# Altium project LM_001_Rev_D.PrjPcb
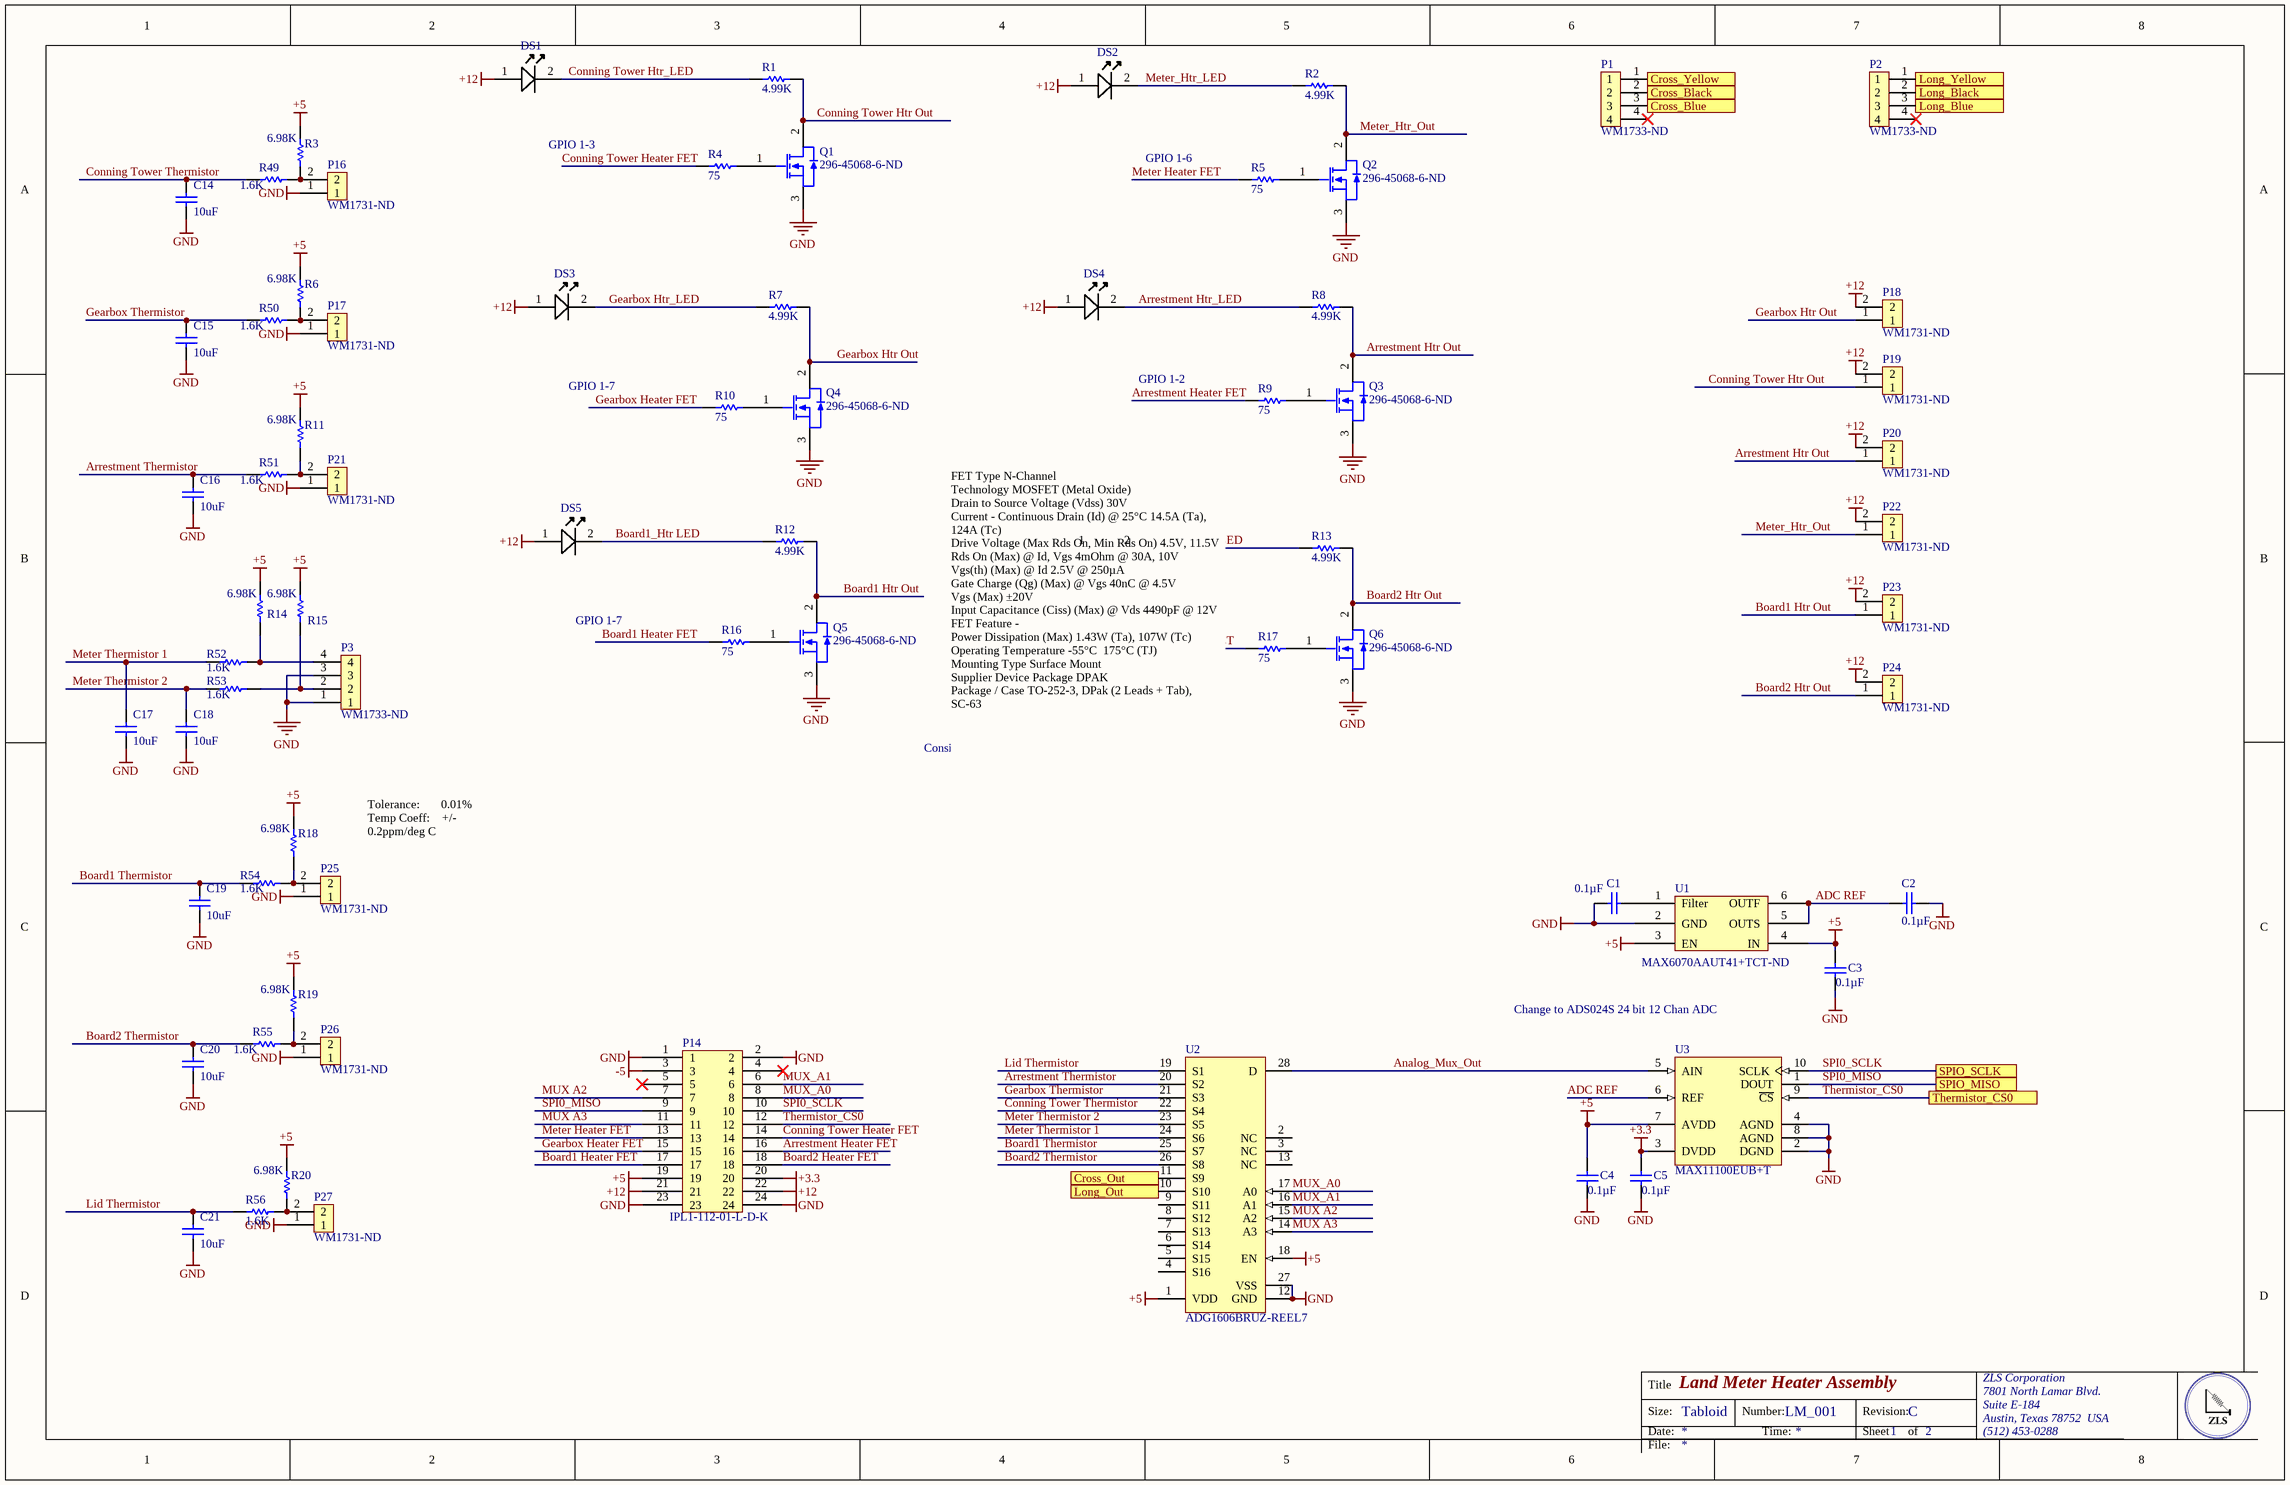
[diagram p0: LM_001.SchDoc]
2 sheets, 116 parts. Net scope: flat (ports and power ports of the same name join across sheets).
Board file: LM_001_Rev_F.PcbDoc
Sheets:
  LM_001.SchDoc
  Signal_Conditioner.SchDoc

## Sheet LM_001.SchDoc: Land Meter Heater Assembly
size Tabloid; DocumentNumber: LM_001; Revision: C; SheetNumber: 1; SheetTotal: 2

### Parts
C1  Capacitance: 0.1µF  [CAPC0805(2012)145_N]  (hidden comment: CAP CER 0.1UF 25V X7R 0805)
C2  Capacitance: 0.1µF  [CAPC0805(2012)145_N]  (hidden comment: CAP CER 0.1UF 25V X7R 0805)
C3  Capacitance: 0.1µF  [CAPC0805(2012)145_N]  (hidden comment: CAP CER 0.1UF 25V X7R 0805)
C4  Capacitance: 0.1µF  [CAPC0805(2012)145_N]  (hidden comment: CAP CER 0.1UF 25V X7R 0805)
C5  Capacitance: 0.1µF  [CAPC0805(2012)145_N]  (hidden comment: CAP CER 0.1UF 25V X7R 0805)
C14  10uF  [CAPC0805(2012)145_N]
C15  10uF  [CAPC0805(2012)145_N]
C16  10uF  [CAPC0805(2012)145_N]
C17  10uF  [CAPC0805(2012)145_N]
C18  10uF  [CAPC0805(2012)145_N]
C19  10uF  [CAPC0805(2012)145_N]
C20  10uF  [CAPC0805(2012)145_N]
C21  10uF  [CAPC0805(2012)145_N]
DS1  LTST-S220KRKT  [0805C_L]  (value not drawn)
DS2  LTST-S220KRKT  [0805C_L]  (value not drawn)
DS3  LTST-S220KRKT  [0805C_L]  (value not drawn)
DS4  LTST-S220KRKT  [0805C_L]  (value not drawn)
DS5  LTST-S220KRKT  [0805C_L]  (value not drawn)
DS6  LTST-S220KRKT  [0805C_L]  (value not drawn)
P1  Supplier Part Number 1: WM1733-ND  [0530470410]  (hidden comment: 0530470410)
P2  Supplier Part Number 1: WM1733-ND  [0530470410]  (hidden comment: 0530470410)
P3  Supplier Part Number 1: WM1733-ND  [0530470410]  (hidden comment: 0530470410)
P14  IPL1-112-01-L-D-K  [IPL1-112-01-F-S-K]
P16  Supplier Part Number 1: WM1731-ND  [0530470210]  (hidden comment: 0530470210)
P17  Supplier Part Number 1: WM1731-ND  [0530470210]  (hidden comment: 0530470210)
P18  Supplier Part Number 1: WM1731-ND  [0530470210]  (hidden comment: 0530470210)
P19  Supplier Part Number 1: WM1731-ND  [0530470210]  (hidden comment: 0530470210)
P20  Supplier Part Number 1: WM1731-ND  [0530470210]  (hidden comment: 0530470210)
P21  Supplier Part Number 1: WM1731-ND  [0530470210]  (hidden comment: 0530470210)
P22  Supplier Part Number 1: WM1731-ND  [0530470210]  (hidden comment: 0530470210)
P23  Supplier Part Number 1: WM1731-ND  [0530470210]  (hidden comment: 0530470210)
P24  Supplier Part Number 1: WM1731-ND  [0530470210]  (hidden comment: 0530470210)
P25  Supplier Part Number 1: WM1731-ND  [0530470210]  (hidden comment: 0530470210)
P26  Supplier Part Number 1: WM1731-ND  [0530470210]  (hidden comment: 0530470210)
P27  Supplier Part Number 1: WM1731-ND  [0530470210]  (hidden comment: 0530470210)
Q1  Supplier Part Number 1: 296-45068-6-ND  [CSD17585F5T]  (hidden comment: CSD17585F5T)
Q2  Supplier Part Number 1: 296-45068-6-ND  [CSD17585F5T]  (hidden comment: CSD17585F5T)
Q3  Supplier Part Number 1: 296-45068-6-ND  [CSD17585F5T]  (hidden comment: CSD17585F5T)
Q4  Supplier Part Number 1: 296-45068-6-ND  [CSD17585F5T]  (hidden comment: CSD17585F5T)
Q5  Supplier Part Number 1: 296-45068-6-ND  [CSD17585F5T]  (hidden comment: CSD17585F5T)
Q6  Supplier Part Number 1: 296-45068-6-ND  [CSD17585F5T]  (hidden comment: CSD17585F5T)
R1  4.99K  [RESC0805(2012)_L]
R2  4.99K  [RESC0805(2012)_L]
R3  6.98K  [RESC0805(2012)_N]
R4  75  [RESC0805(2012)_L]
R5  75  [RESC0805(2012)_L]
R6  6.98K  [RESC0805(2012)_N]
R7  4.99K  [RESC0805(2012)_L]
R8  4.99K  [RESC0805(2012)_L]
R9  75  [RESC0805(2012)_L]
R10  75  [RESC0805(2012)_L]
R11  6.98K  [RESC0805(2012)_N]
R12  4.99K  [RESC0805(2012)_L]
R13  4.99K  [RESC0805(2012)_L]
R14  6.98K  [RESC0805(2012)_N]
R15  6.98K  [RESC0805(2012)_N]
R16  75  [RESC0805(2012)_L]
R17  75  [RESC0805(2012)_L]
R18  6.98K  [RESC0805(2012)_N]
R19  6.98K  [RESC0805(2012)_N]
R20  6.98K  [RESC0805(2012)_N]
R49  1.6K  [RESC0805(2012)_N]
R50  1.6K  [RESC0805(2012)_N]
R51  1.6K  [RESC0805(2012)_N]
R52  1.6K  [RESC0805(2012)_N]
R53  1.6K  [RESC0805(2012)_N]
R54  1.6K  [RESC0805(2012)_N]
R55  1.6K  [RESC0805(2012)_N]
R56  1.6K  [RESC0805(2012)_N]
U1  Supplier Part Number 1: MAX6070AAUT41+TCT-ND  [SOT95P280X445-6N]  (hidden comment: MAX6070AAUT41+T)
U2  ADG1606BRUZ-REEL7  [ADI-RU-28_M]
U3  MAX11100EUB+T  [U10+2_L]

### Ports
Cross_Black, Cross_Blue, Cross_Out, Cross_Yellow, Long_Black, Long_Blue, Long_Out, Long_Yellow, SPIO_MISO, SPIO_SCLK, Thermistor_CS0

### Nets
+3.3: C5.1 P14.20 U3.3(DVDD)
+5: C3.1 C4.1 P14.19 R3.2 R6.2 R11.2 R14.2 R15.2 R18.2 R19.2 R20.2 U1.3(EN) U1.4(IN) U2.1(VDD) U2.18(EN) U3.7(AVDD)
+12: DS1.1(A) DS2.1(A) DS3.1(A) DS4.1(A) DS5.1(A) DS6.1(A) P14.21 P14.22 P18.2 P19.2 P20.2 P22.2 P23.2 P24.2
-5: P14.3
GND: C1.1 C2.2 C3.2 C4.2 C5.2 C14.2 C15.2 C16.2 C17.2 C18.2 C19.2 C20.2 C21.2 P3.1 P3.3 P14.1 P14.2 P14.23 P14.24 P16.1 P17.1 P21.1 P25.1 P26.1 P27.1 Q1.3(S) Q2.3(S) Q3.3(S) Q5.3(S) U1.2(GND) U2.12(GND) U2.27(VSS) U3.2(DGND) U3.4(AGND) U3.8(AGND)
ADC REF: C2.1 U1.5(OUTS) U1.6(OUTF) U3.6(REF)
Analog_Mux_Out: U2.28(D) U3.5(AIN)
Arrestment Heater FET: P14.16 R9.1
Arrestment Htr Out: P20.1 Q3.2(D) R8.1
Arrestment Htr_LED: DS4.2(K) R8.2
Arrestment Thermistor: C16.1 R51.2 U2.20(S2)
Board1 Heater FET: P14.17 R16.1
Board1 Htr Out: P23.1 Q5.2(D) R12.1
Board1 Thermistor: C19.1 R54.2 U2.25(S7)
Board1_Htr LED: DS5.2(K) R12.2
Board2 Heater FET: P14.18 R17.1
Board2 Htr Out: P24.1 Q6.2(D) R13.1
Board2 Thermistor: C20.1 R55.2 U2.26(S8)
Board2_Htr LED: DS6.2(K) R13.2
Conning Tower Heater FET: P14.14 R4.1
Conning Tower Htr Out: P19.1 Q1.2(D) R1.1
Conning Tower Htr_LED: DS1.2(K) R1.2
Conning Tower Thermistor: C14.1 R49.2 U2.22(S4)
CROSS NEUTRAL: P1.2 ; port Cross_Black
Gearbox Heater FET: P14.15 R10.1
Gearbox Htr Out: P18.1 Q4.2(D) R7.1
Gearbox Htr_LED: DS3.2(K) R7.2
Gearbox Thermistor: C15.1 R50.2 U2.21(S3)
Lid Thermistor: C21.1 R56.2 U2.19(S1)
LONG NEUTRAL: P2.2 ; port Long_Black
Meter Heater FET: P14.13 R5.1
Meter Thermistor 1: C17.1 R52.2 U2.24(S6)
Meter Thermistor 2: C18.1 R53.2 U2.23(S5)
Meter_Htr_LED: DS2.2(K) R2.2
Meter_Htr_Out: P22.1 Q2.2(D) R2.1
MUX A2: P14.7 U2.15(A2)
MUX A3: P14.11 U2.14(A3)
MUX_A0: P14.8 U2.17(A0)
MUX_A1: P14.6 U2.16(A1)
SPI0_MISO: P14.9 U3.1(DOUT) ; port SPIO_MISO
SPI0_SCLK: P14.10 U3.10(SCLK) ; port SPIO_SCLK
Thermistor_CS0: P14.12 U3.9(~{CS}) ; port Thermistor_CS0
NetC1_2: C1.2 U1.1(Filter)
NetC6_2: P2.1 ; port Long_Yellow
NetC11_2: P1.1 ; port Cross_Yellow
NetC22_1: U2.10(S10) ; port Long_Out
NetC23_1: U2.11(S9) ; port Cross_Out
NetP1_3: P1.3 ; port Cross_Blue
NetP2_3: P2.3 ; port Long_Blue
NetP3_2: P3.2 R15.1 R53.1
NetP3_4: P3.4 R14.1 R52.1
NetP16_2: P16.2 R3.1 R49.1
NetP17_2: P17.2 R6.1 R50.1
NetP21_2: P21.2 R11.1 R51.1
NetP25_2: P25.2 R18.1 R54.1
NetP26_2: P26.2 R19.1 R55.1
NetP27_2: P27.2 R20.1 R56.1
NetQ1_1: Q1.1(G) R4.2
NetQ2_1: Q2.1(G) R5.2
NetQ3_1: Q3.1(G) R9.2
NetQ4_1: Q4.1(G) R10.2
NetQ5_1: Q5.1(G) R16.2
NetQ6_1: Q6.1(G) R17.2

Not connected (* = marked no-connect by the designer): P1 4*; P2 4*; P14 4* 5*; Q4 3(S); Q6 3(S); U2 2(NC) 3(NC) 4(S16) 5(S15) 6(S14) 7(S13) 8(S12) 9(S11) 13(NC)

### Notes on the sheet
- GPIO 1-3
- GPIO 1-6
- GPIO 1-7
- GPIO 1-2
- Consider using GPIO Expander (MCP23S17 or XRA1405)
- (near DS6) FET Type	N-Channel
  Technology	MOSFET (Metal Oxide)
  Drain to Source Voltage (Vdss)	30V
  Current - Continuous Drain (Id) @ 25°C	14.5A (Ta), 124A (Tc)
  Drive Voltage (Max Rds On, Min Rds On)	4.5V, 11.5V
  Rds On (Max) @ Id, Vgs	4mOhm @ 30A, 10V
  Vgs(th) (Max) @ Id	2.5V @ 250µA
  Gate Charge (Qg) (Max) @ Vgs	40nC @ 4.5V
  Vgs (Max)	±20V
  Input Capacitance (Ciss) (Max) @ Vds	4490pF @ 12V
  FET Feature	-
  Power Dissipation (Max)	1.43W (Ta), 107W (Tc)
  Operating Temperature	-55°C  175°C (TJ)
  Mounting Type	Surface Mount
  Supplier Device Package	DPAK
  Package / Case	TO-252-3, DPak (2 Leads + Tab), SC-63
- Tolerance:       0.01%
  Temp Coeff:    +/- 0.2ppm/deg C
- Change to ADS024S 24 bit 12 Chan ADC
- Labels drawn without touching a wire or pin: GND
- Title
- Size:
- Date:
- Tabloid
- Number:
- Time:
- Revision:
- Sheet
- of
- ZLS Corporation
- 7801 North Lamar Blvd.
- Suite E-184
- Austin, Texas 78752  USA
- (512) 453-0288
- File:

### Library data of the parts
C1-C5 = CMP-1036-04795-1: Manufacturer: Murata Electronics North America; Manufacturer Part Number: GRM21BR71E104KA01L; Tolerance: ±10%; Supplier 1: Digi-Key; Supplier Part Number 1: 490-1673-6-ND; RoHS: RoHS Compliant; Category: Capacitors; Stock 1: 891652; Pricing 1: 1=0.2, 10=0.145, 100=0.0683, 500=0.04788, 1000=0.03964 (USD); Packaging: Digi-Reel®; Part Status: Active; Voltage - Rated: 25V; Temperature Coefficient: X7R; Operating Temperature: -55°C ~ 125°C; Features: -; Ratings: -; Applications: General Purpose; Mounting Type: Surface Mount, MLCC; Package / Case: 0805 (2012 Metric); Size / Dimension: 0.079" L x 0.049" W (2.00mm x 1.25mm); Height - Seated (Max): -; Thickness (Max): 0.053" (1.35mm); Lead Spacing: -; Lead Style: -; ComponentLink1URL: http://www.murata.com/~/media/webrenewal/support/library/catalog/products/capacitor/mlcc/c02e.ashx; ComponentLink1Description: http://www.murata.com/~/media/webrenewal/support/library/catalog/products/capacitor/mlcc/c02e.ashx
C14-C21 = CMP-1036-04795-1: CAP CER 10UF 16V X6S 0805; Manufacturer: TDK Corporation; Manufacturer Part Number: C2012X6S1C106K085AC; Tolerance: ±10%; Notification: Current market demand for these product types have resulted in fluctuating and extending lead times. Lead times may differ.; Supplier 1: Digi-Key; Supplier Part Number 1: 445-14483-6-ND; RoHS: RoHS Compliant; Category: Capacitors; Stock 1: 0; Pricing 1: 1=0.38, 10=0.259, 100=0.1466, 500=0.1035, 1000=0.09056 (USD); Packaging: Digi-Reel®; Part Status: Active; Voltage - Rated: 16V; Temperature Coefficient: X6S; Operating Temperature: -55°C ~ 105°C; Features: Low ESL; Ratings: -; Applications: General Purpose; Failure Rate: -; Mounting Type: Surface Mount, MLCC; Package / Case: 0805 (2012 Metric); Size / Dimension: 0.079" L x 0.049" W (2.00mm x 1.25mm); Height - Seated (Max): -; Thickness (Max): 0.039" (1.00mm); Lead Spacing: -; Lead Style: -; ComponentLink1URL: https://product.tdk.com/info/en/catalog/datasheets/mlcc_commercial_general_en.pdf; ComponentLink1Description: https://product.tdk.com/info/en/catalog/datasheets/mlcc_commercial_general_en.pdf
DS1-DS6 = LED A/K: LED RED CLEAR CHIP SMD R/A; Manufacturer: Vishay / Lite-On; Lens Colour: Colorless; Lens Style: Diffused,Colorless; Viewing Angle: 130°; Luminous Intensity: 54mcd; Forward Current: 20mA; Forward Voltage: 2V; Power Rating: 75mW; Dominant Wavelength: 631nm; Number of Elements: 1; Wavelength: 639nm; Supplier 1: Digi-Key; Supplier Part Number 1: 160-1469-1-ND; Manufacturer Part Number: LTST-S220KRKT; Stock 1: 108191; Pricing 1: 1=0.31, 10=0.225, 25=0.1656, 100=0.1183, 250=0.0804, 500=0.071, 1000=0.0556 (USD); Mount: Surface Mount; Case/Package: 0805; Number of Pins: 2; Colour: Red; Case Code (Metric): 2012; Case Code (Imperial): 0805; Min Operating Temperature: -55°C; Max Operating Temperature: 85°C; Packaging: Tape and Reel; Package Quantity: 4000; Illumination Colour: Red; Test Current: 20mA; Lens Transparency: Clear; Power Dissipation: 75mW; Number of LEDs: 1; Length: 2.1mm; Height: 0.6mm; Width: 1mm; Depth: 0.6mm; Radiation Hardening: No; Lead Free: Lead Free; ComponentLink1URL: https://datasheet.ciiva.com/2110/s-110-ltst-s220krkt-2110132.pdf; ComponentLink1Description: https://datasheet.ciiva.com/2110/s-110-ltst-s220krkt-2110132.pdf; ComponentLink2URL: https://datasheet.ciiva.com/2110/s-110-ltst-s220krkt-2110133.pdf; ComponentLink2Description: https://datasheet.ciiva.com/2110/s-110-ltst-s220krkt-2110133.pdf; ComponentLink3URL: https://datasheet.ciiva.com/2110/s-110-ltst-s220krkt-2110134.pdf; ComponentLink3Description: https://datasheet.ciiva.com/2110/s-110-ltst-s220krkt-2110134.pdf; ComponentLink4URL: https://datasheet.ciiva.com/12403/lite-on-ltst-s220krkt-187389-12403798.pdf; ComponentLink4Description: https://datasheet.ciiva.com/12403/lite-on-ltst-s220krkt-187389-12403798.pdf; ComponentLink5URL: https://datasheet.ciiva.com/16345/lite-onltst-s220krkt-16345511.pdf; ComponentLink5Description: https://datasheet.ciiva.com/16345/lite-onltst-s220krkt-16345511.pdf; ComponentLink6URL: https://datasheet.ciiva.com/15118/getdatasheetpartid-225752-15118120.pdf; ComponentLink6Description: https://datasheet.ciiva.com/15118/getdatasheetpartid-225752-15118120.pdf; ComponentLink7URL: https://datasheet.ciiva.com/14633/0900766b80dc0b76-14633737.pdf; ComponentLink7Description: https://datasheet.ciiva.com/14633/0900766b80dc0b76-14633737.pdf; ComponentLink8URL: https://datasheet.ciiva.com/11775/0900766b80dc0b76-11775439.pdf; ComponentLink8Description: https://datasheet.ciiva.com/11775/0900766b80dc0b76-11775439.pdf
P1-P3 = 0530470410: CONN HEADER VERT 4POS 1.25MM; Manufacturer: Molex; Description: Conn Wire to Board HDR 4 POS 1.25mm Solder ST Thru-Hole PicoBlade™ Tray; Contact Resistance: 20mR; Number of Positions: 4; Max Voltage Rating (AC): 125V; Connector Type: Blade Pin; Supplier 1: Digi-Key; Manufacturer Part Number: 0530470410; Stock 1: 21727; Pricing 1: 1=0.28, 10=0.261, 100=0.183, 500=0.15688, 1000=0.13073, 5000=0.11205, 10000=0.10458 (USD); Mount: Through Hole; Contact Plating: Tin; Contact Material: Bronze; Color: Natural; Housing Color: White; Housing Material: Nylon; Min Operating Temperature: -40°C; Max Operating Temperature: 85°C; Packaging: Tray; Number of Rows: 1; Termination: Solder; Number of Contacts: 4; Orientation: Straight; Length: 6.75mm; Pitch: 1.25mm; Contact Mating Length: 0.089inch; Depth: 3.2mm; ComponentLink1URL: http://components.arrow.com/part/dataview/2938462S4237926N3303?src-supplier=Arrow; ComponentLink1Description: http://components.arrow.com/part/dataview/2938462S4237926N3303?src-supplier=Arrow
P14 = IPL1-112-01-F-S-K: Manufacturer: Samtec Inc.; Connector Type: Header; Pitch - Mating: 0.100" (2.54mm); Number of Positions: 24; Number of Positions Loaded: All; Style: Board to Cable/Wire; Shrouding: Shrouded - 4 Wall; Contact Length - Mating: 0.215" (5.46mm); Contact Length - Post: 0.120" (3.05mm); Material Flammability Rating: UL94 V-0; Voltage Rating: 675VAC, 954VDC; Supplier 1: Digi-Key; Supplier Part Number 1: SAM10587-ND; Manufacturer Part Number: IPL1-112-01-L-D-K; RoHS: RoHS Compliant; Category: Connectors, Interconnects; Stock 1: 142; Pricing 1: 1=3.8, 18=3.64778, 108=3.04, 504=2.58401, 1008=2.204, 5004=1.976 (USD); Packaging: Tube; Part Status: Active; Contact Type: Male Pin; Number of Rows: 2; Row Spacing - Mating: 0.100" (2.54mm); Mounting Type: Through Hole; Termination: Solder; Fastening Type: Locking Ramp; Overall Contact Length: -; Insulation Height: 0.320" (8.13mm); Contact Shape: Square; Contact Finish - Mating: Gold; Contact Finish Thickness - Mating: 10.0µin (0.25µm); Contact Finish - Post: Tin; Contact Material: Phosphor Bronze; Insulation Material: Liquid Crystal Polymer (LCP); Features: -; Operating Temperature: -55°C ~ 125°C; Ingress Protection: -; Insulation Color: Natural; Current Rating: -; Mated Stacking Heights: -; Contact Finish Thickness - Post: -; Applications: -; ComponentLink1URL: http://suddendocs.samtec.com/prints/ipl1-1xx-xx-xxx-d-xx-x-xx-mkt.pdf; ComponentLink1Description: http://suddendocs.samtec.com/prints/ipl1-1xx-xx-xxx-d-xx-x-xx-mkt.pdf
P16-P27 = 0530470210: CONN HEADER VERT 2POS 1.25MM; Manufacturer: Molex; Description: Conn Shrouded Header HDR 2 POS 1.25mm Solder ST Thru-Hole PicoBlade™ Tray; Contact Resistance: 20mR; Number of Positions: 2; Connector Type: Blade Pin; Supplier 1: Digi-Key; Manufacturer Part Number: 0530470210; Stock 1: 100609; Pricing 1: 1=0.19, 10=0.177, 100=0.1227, 500=0.10384, 1000=0.08496, 5000=0.07552, 10000=0.06844 (USD); Mount: Through Hole; Contact Plating: Tin; Contact Material: Bronze; Color: Natural; Housing Color: Beige; Housing Material: Nylon; Min Operating Temperature: -40°C; Max Operating Temperature: 85°C; Number of Rows: 1; Packaging: Tray; Termination: Solder; Number of Contacts: 2; Orientation: Straight; Length: 4.25mm; Pitch: 1.25mm; Depth: 3.2mm; Contact Mating Length: 0.089inch; ComponentLink1URL: http://components.arrow.com/part/dataview/2938464S3509005N3303?src-supplier=Arrow; ComponentLink1Description: http://components.arrow.com/part/dataview/2938464S3509005N3303?src-supplier=Arrow; ComponentLink2URL: https://www.molex.com/pdm_docs/sd/530470210_sd.pdf?src-supplier=Digi-Key; ComponentLink2Description: https://www.molex.com/pdm_docs/sd/530470210_sd.pdf?src-supplier=Digi-Key
Q1-Q6 = CSD17585F5T: MOSFET N-CH 30V 5.9A PICOSTAR; Supplier 1: Digi-Key
R1 R2 R7 R8 R12 R13 = CMP-1013-00393-1: RES SMD 4.99K OHM 1% 1/8W 0805; Manufacturer: Vishay Dale; Manufacturer Part Number: CRCW08054K99FKEA; Power (Watts): 0.125W, 1/8W; Temperature Coefficient: ±100ppm/°C; Supplier 1: Digi-Key; Supplier Part Number 1: 541-4.99KCCT-ND; RoHS: RoHS Compliant; Category: Resistors; Stock 1: 93740; Pricing 1: 1=0.1, 10=0.044, 100=0.0178, 1000=0.00802, 2500=0.00696 (USD); Packaging: Cut Tape (CT); Part Status: Active; Resistance (Ohms): 4.99k; Tolerance: ±1%; Composition: Thick Film; Features: Automotive AEC-Q200; Operating Temperature: -55°C ~ 155°C; Package / Case: 0805 (2012 Metric); Supplier Device Package: 0805; Size / Dimension: 0.079" L x 0.049" W (2.00mm x 1.25mm); Height - Seated (Max): 0.020" (0.50mm); Failure Rate: -; ComponentLink1URL: http://www.vishay.com/docs/20035/dcrcwe3.pdf; ComponentLink1Description: http://www.vishay.com/docs/20035/dcrcwe3.pdf
R3 R6 R11 R14 R15 R18-R20 = CMP-1013-00606-1: RES SMD 6.98K OHM 1% 1/8W 0805; Manufacturer: Vishay Dale; Manufacturer Part Number: CRCW08056K98FKEA; Power (Watts): 0.125W, 1/8W; Temperature Coefficient: ±100ppm/°C; Supplier 1: Digi-Key; Supplier Part Number 1: 541-6.98KCCT-ND; RoHS: RoHS Compliant; Category: Resistors; Stock 1: 573; Pricing 1: 1=0.1, 10=0.055, 100=0.0223, 1000=0.01003, 2500=0.0087 (USD); Packaging: Cut Tape (CT); Part Status: Active; Tolerance: ±1%; Composition: Thick Film; Features: Automotive AEC-Q200; Operating Temperature: -55°C ~ 155°C; Package / Case: 0805 (2012 Metric); Supplier Device Package: 0805; Size / Dimension: 0.079" L x 0.049" W (2.00mm x 1.25mm); Height - Seated (Max): 0.020" (0.50mm); Failure Rate: -; ComponentLink1URL: http://www.vishay.com/docs/20035/dcrcwe3.pdf; ComponentLink1Description: http://www.vishay.com/docs/20035/dcrcwe3.pdf
R4 R5 R9 R10 R16 R17 = CMP-1013-00393-1: RES SMD 75 OHM 1% 1/8W 0805; Manufacturer: Vishay Dale; Manufacturer Part Number: CRCW080575R0FKTA; Power (Watts): 0.125W, 1/8W; Temperature Coefficient: ±100ppm/°C; Supplier 1: Digi-Key; Supplier Part Number 1: 541-3031-1-ND; RoHS: RoHS non-compliant; Category: Resistors; Stock 1: 1088; Pricing 1: 1=0.16, 10=0.142, 100=0.0546, 1000=0.02401, 2500=0.02073 (USD); Packaging: Cut Tape (CT); Part Status: Active; Tolerance: ±1%; Composition: Thick Film; Features: Automotive AEC-Q200; Operating Temperature: -55°C ~ 155°C; Package / Case: 0805 (2012 Metric); Supplier Device Package: 0805; Size / Dimension: 0.079" L x 0.049" W (2.00mm x 1.25mm); Height - Seated (Max): 0.020" (0.50mm); Failure Rate: -; ComponentLink1URL: http://www.vishay.com/docs/20008/dcrcw.pdf; ComponentLink1Description: http://www.vishay.com/docs/20008/dcrcw.pdf
R49-R56 = CMP-1013-00606-1: RES SMD 1.6K OHM 1% 1/8W 0805
U1 = MAX6070AAUT41+T: IC VREF SERIES 4.096V SOT23; Manufacturer: Maxim Integrated; Output Type: Fixed; Tolerance: ±0.04%; Temperature Coefficient: 6ppm/°C; Noise - 0.1Hz to 10Hz: 9.6µVp-p; Noise - 10Hz to 10kHz: 9µVrms; Voltage - Input: 4.3 V ~ 5.5 V; Current - Supply: 350µA; Supplier 1: Digi-Key; Manufacturer Part Number: MAX6070AAUT41+T; RoHS: RoHS Compliant; Category: Integrated Circuits (ICs); Stock 1: 2623; Pricing 1: 1=3.41, 10=3.213, 25=2.5704, 50=2.4418, 100=2.2491, 250=2.13344, 500=2.05634 (USD); Packaging: Cut Tape (CT); Part Status: Active; Reference Type: Series; Voltage - Output (Min/Fixed): 4.096V; Operating Temperature: -40°C ~ 125°C (TA); Mounting Type: Surface Mount; Package / Case: SOT-23-6; Supplier Device Package: SOT-23-6; ComponentLink1URL: https://datasheets.maximintegrated.com/en/ds/MAX6070-MAX6071.pdf; ComponentLink1Description: https://datasheets.maximintegrated.com/en/ds/MAX6070-MAX6071.pdf
U2 = CMP-0793-00166-1: 4.5 Ohm Ron, 16-Channel, +/-5 V,+12 V,+5 V and +3.3 V Multiplexer, 28-pin SOP (RU-28), Reel; Manufacturer: Analog Devices; Ron (ohms): 4; t transition (s): 143n; Bandwidth (Hz): 21M, 22M, 19M, 17M; Max Analog Signal Range: Vss to Vdd; ComponentLink1URL: http://www.analog.com/en/index.html; PartNumber: ADG1606BRUZ-REEL7; ComponentLink3URL: http://www.analog.com/static/imported-files/packages/249854663RU_28.pdf; ComponentLink2URL: http://www.analog.com/static/imported-files/data_sheets/ADG1606_1607.pdf; ComponentLink2Description: Datasheet; Mounting Technology: Surface Mount; PackageDescription: 28-Pin Thin Shrink Small Outline Package, Body 9.7 x 4.4 mm, Pitch 0.65 mm; PackageReference: RU-28; ComponentLink3Description: Package Specification; Packing: Reel; Code_JEDEC: MO-153-AE; DatasheetVersion: Rev. 0; ComponentLink1Description: Manufacturer URL; PackageVersion: Mar-05
U3 = CMP-0249-00017-1: 16-Bit, +5V, 200ksps ADC with 10uA Shutdown, 10-Pin uMAX, -40°C to +85°C, Pb-Free, Tape and Reel; DatasheetVersion: Rev 1, Jan-2012; ComponentLink3URL: http://pdfserv.maxim-ic.com/package_dwgs/21-0061.PDF; PackageReference: U10+2; ComponentLink2URL: http://datasheets.maxim-ic.com/en/ds/MAX11100.pdf; PackageVersion: revL, 2008; ComponentLink1Description: Manufacturer URL; Code_JEDEC: MO-187-BA; ComponentLink1URL: http://www.maxim-ic.com; ComponentLink3Description: Package Specification; PackageDescription: 10-Pin Micro-MAX Thin Shrink Small Outline (uSOP), 3 x 3 x 0.85 mm Body, 0.5 mm Pitch, Pb-Free; ComponentLink2Description: Datasheet

## Sheet Signal_Conditioner.SchDoc: Signal Conditioner
size Tabloid; DocumentNumber: LM-001; Revision: C; SheetNumber: 2; SheetTotal: 2; DocumentName: Signal Conditioner
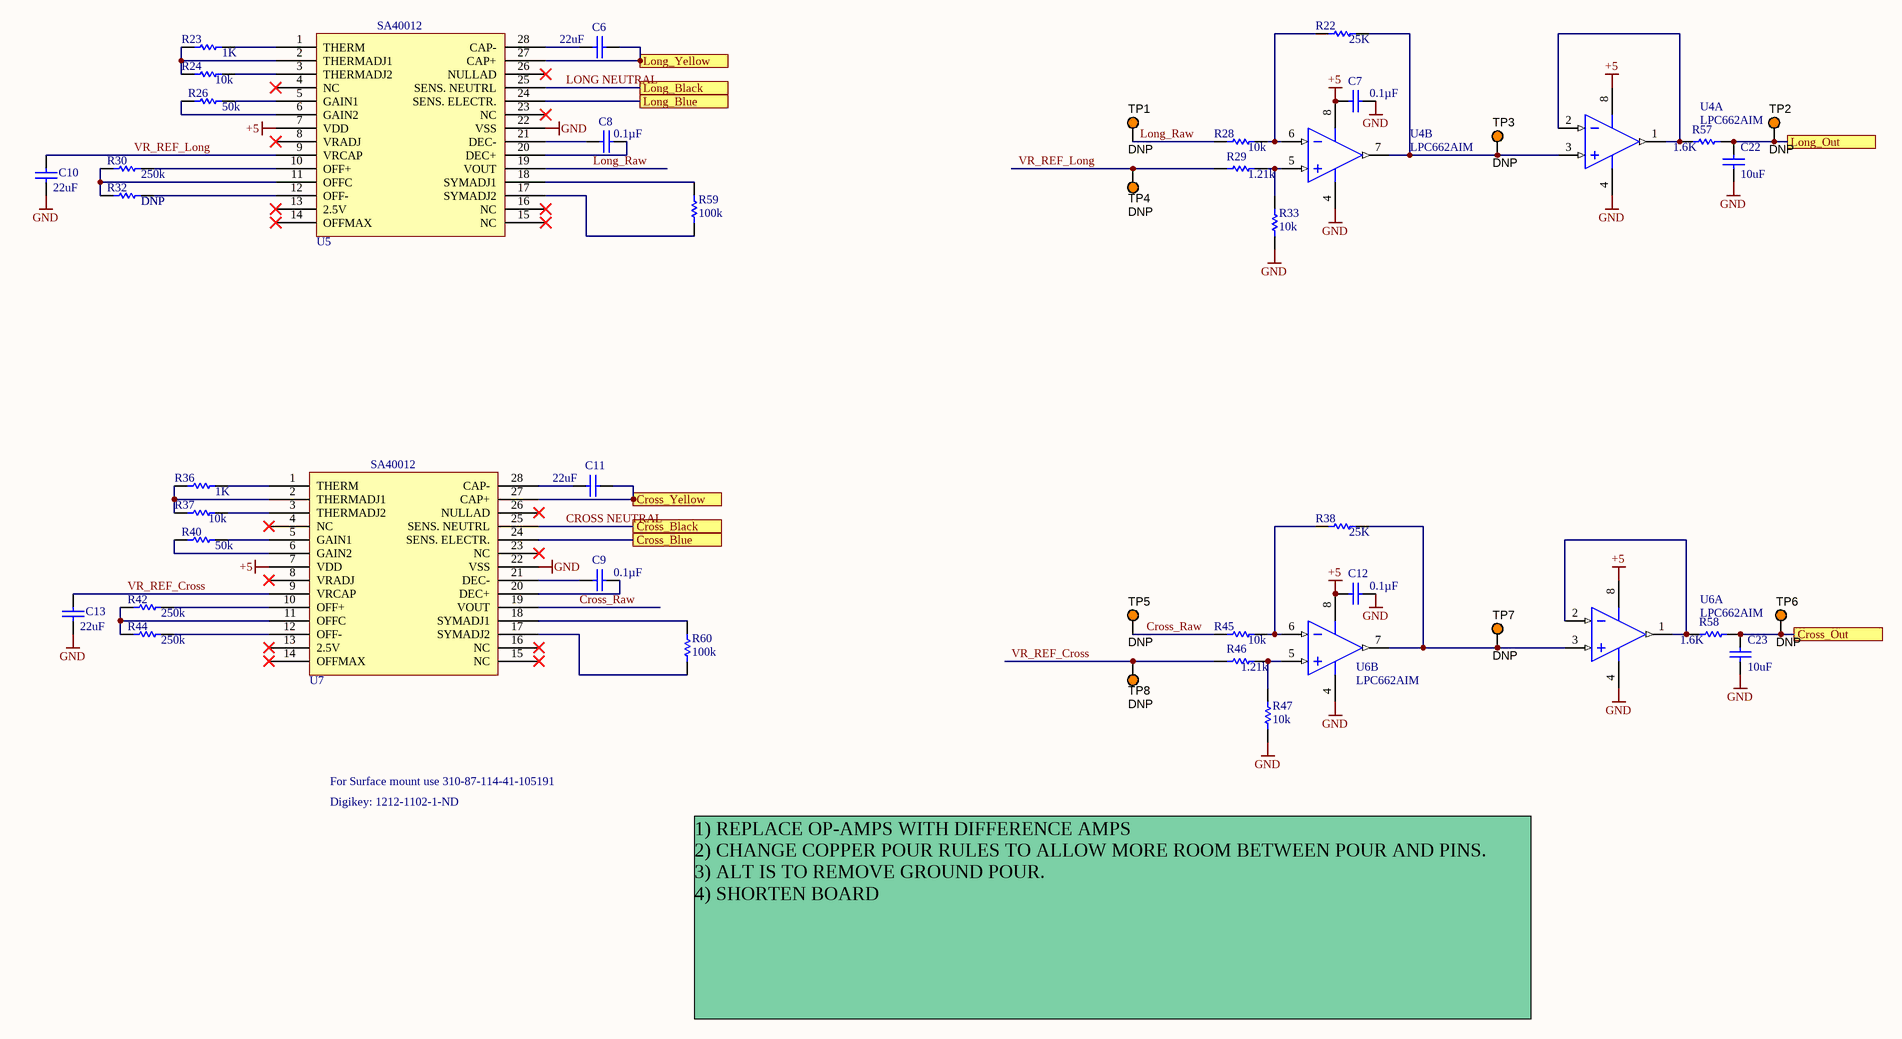
[diagram p1: Signal_Conditioner.SchDoc]

### Parts
C6  22uF  [CAPC0805(2012)145_N]
C7  Capacitance: 0.1µF  [CAPC0805(2012)145_N]  (hidden comment: CAP CER 0.1UF 25V X7R 0805)
C8  Capacitance: 0.1µF  [CAPC0805(2012)145_N]  (hidden comment: CAP CER 0.1UF 25V X7R 0805)
C9  Capacitance: 0.1µF  [CAPC0805(2012)145_N]  (hidden comment: CAP CER 0.1UF 25V X7R 0805)
C10  22uF  [CAPC0805(2012)145_N]
C11  22uF  [CAPC0805(2012)145_N]
C12  Capacitance: 0.1µF  [CAPC0805(2012)145_N]  (hidden comment: CAP CER 0.1UF 25V X7R 0805)
C13  22uF  [CAPC0805(2012)145_N]
C22  10uF  [CAPC0805(2012)145_N]
C23  10uF  [CAPC0805(2012)145_N]
R22  25K  [RESC0805(2012)_L]
R23  1K  [RESC0805(2012)_L]
R24  10k  [RESC0805(2012)_L]
R26  50k  [RESC0805(2012)_L]
R28  10k  [RESC0805(2012)_L]
R29  1.21k  [RESC0805(2012)_L]
R30  250k  [RESC0805(2012)_L]
R32  DNP  [RESC0805(2012)_L]
R33  10k  [RESC0805(2012)_L]
R36  1K  [RESC0805(2012)_L]
R37  10k  [RESC0805(2012)_L]
R38  25K  [RESC0805(2012)_L]
R40  50k  [RESC0805(2012)_L]
R42  250k  [RESC0805(2012)_L]
R44  250k  [RESC0805(2012)_L]
R45  10k  [RESC0805(2012)_L]
R46  1.21k  [RESC0805(2012)_L]
R47  10k  [RESC0805(2012)_L]
R57  1.6K  [RESC0805(2012)_N]
R58  1.6K  [RESC0805(2012)_N]
R59  100k  [RESC0805(2012)_L]
R60  100k  [RESC0805(2012)_L]
TP1  DNP  [KSTN-5003]
TP2  DNP  [KSTN-5003]
TP3  DNP  [KSTN-5003]
TP4  DNP  [KSTN-5003]
TP5  DNP  [KSTN-5003]
TP6  DNP  [KSTN-5003]
TP7  DNP  [KSTN-5003]
TP8  DNP  [KSTN-5003]
U4  LPC662AIM  [D0008A_M]  (parts A,B of 2)
U5  SA40012  [SA40012]
U6  LPC662AIM  [D0008A_M]  (parts A,B of 2)
U7  SA40012  [SA40012]

### Ports
Cross_Black, Cross_Blue, Cross_Out, Cross_Yellow, Long_Black, Long_Blue, Long_Out, Long_Yellow

### Nets
+5: C7.1 C12.1 U4.8(V+) U5.7(VDD) U6.8(V+) U7.7(VDD)
GND: C7.2 C10.2 C12.2 C13.2 C22.2 C23.2 R33.1 R47.1 U4.4(V-) U5.22(VSS) U6.4(V-) U7.22(VSS)
CROSS NEUTRAL: U7.25(SENS._NEUTRL) ; port Cross_Black
Cross_Raw: R45.1 TP5.1 U7.19(VOUT)
LONG NEUTRAL: U5.25(SENS._NEUTRL) ; port Long_Black
Long_Raw: R28.1 TP1.1 U5.19(VOUT)
VR_REF_Cross: C13.1 R46.2 TP8.1 U7.9(VRCAP)
VR_REF_Long: C10.1 R29.2 TP4.1 U5.9(VRCAP)
NetC6_1: C6.1 U5.28(CAP-)
NetC6_2: C6.2 U5.27(CAP+) ; port Long_Yellow
NetC8_1: C8.1 U5.21(DEC-)
NetC8_2: C8.2 U5.20(DEC+)
NetC9_1: C9.1 U7.21(DEC-)
NetC9_2: C9.2 U7.20(DEC+)
NetC11_1: C11.1 U7.28(CAP-)
NetC11_2: C11.2 U7.27(CAP+) ; port Cross_Yellow
NetC22_1: C22.1 R57.1 TP2.1 ; port Long_Out
NetC23_1: C23.1 R58.1 TP6.1 ; port Cross_Out
NetP1_3: U7.24(SENS._ELECTR.) ; port Cross_Blue
NetP2_3: U5.24(SENS._ELECTR.) ; port Long_Blue
NetR22_1: R22.1 R28.2 U4.6(INB-)
NetR22_2: R22.2 TP3.1 U4.3(INA+) U4.7(OUTB)
NetR23_1: R23.1 R24.1 U5.2(THERMADJ1)
NetR23_2: R23.2 U5.1(THERM)
NetR24_2: R24.2 U5.3(THERMADJ2)
NetR26_1: R26.1 U5.6(GAIN2)
NetR26_2: R26.2 U5.5(GAIN1)
NetR29_1: R29.1 R33.2 U4.5(INB+)
NetR30_1: R30.1 R32.1 U5.11(OFFC)
NetR30_2: R30.2 U5.10(OFF+)
NetR32_2: R32.2 U5.12(OFF-)
NetR36_1: R36.1 R37.1 U7.2(THERMADJ1)
NetR36_2: R36.2 U7.1(THERM)
NetR37_2: R37.2 U7.3(THERMADJ2)
NetR38_1: R38.1 R45.2 U6.6(INB-)
NetR38_2: R38.2 TP7.1 U6.3(INA+) U6.7(OUTB)
NetR40_1: R40.1 U7.6(GAIN2)
NetR40_2: R40.2 U7.5(GAIN1)
NetR42_1: R42.1 R44.1 U7.11(OFFC)
NetR42_2: R42.2 U7.10(OFF+)
NetR44_2: R44.2 U7.12(OFF-)
NetR46_1: R46.1 R47.2 U6.5(INB+)
NetR57_2: R57.2 U4.1(OUTA) U4.2(INA-)
NetR58_2: R58.2 U6.1(OUTA) U6.2(INA-)
NetR59_1: R59.1 U5.17(SYMADJ2)
NetR59_2: R59.2 U5.18(SYMADJ1)
NetR60_1: R60.1 U7.17(SYMADJ2)
NetR60_2: R60.2 U7.18(SYMADJ1)

Not connected (* = marked no-connect by the designer): U5 4(NC)* 8(VRADJ)* 13(2.5V)* 14(OFFMAX)* 15(NC)* 16(NC)* 23(NC)* 26(NULLAD)*; U7 4(NC)* 8(VRADJ)* 13(2.5V)* 14(OFFMAX)* 15(NC)* 16(NC)* 23(NC)* 26(NULLAD)*

### Notes on the sheet
- (near R32) DNP
- For Surface mount use 310-87-114-41-105191
- Digikey: 1212-1102-1-ND
- 1) REPLACE OP-AMPS WITH DIFFERENCE AMPS
  2) CHANGE COPPER POUR RULES TO ALLOW MORE ROOM BETWEEN POUR AND PINS.
  3) ALT IS TO REMOVE GROUND POUR.
  4) SHORTEN BOARD
- Title
- Size:
- Date:
- Tabloid
- Number:
- Time:
- Revision:
- Sheet
- of
- ZLS Corporation
- 7801 North Lamar Blvd.
- Suite E-184
- Austin, Texas 78752  USA
- (512) 453-0288
- File:

### Library data of the parts
C6 C10 C11 C13 = CMP-1036-04795-1: CAP CER 22UF 16V X5R 0805; Manufacturer: Murata Electronics North America; Manufacturer Part Number: GRM219R61C226ME15L; Tolerance: ±20%; Notification: Current market demand for these product types have resulted in fluctuating and extending lead times. Lead times may differ.; Supplier 1: Digi-Key; Supplier Part Number 1: 490-9952-1-ND; RoHS: RoHS Compliant; Category: Capacitors; Stock 1: 200; Pricing 1: 1=0.51, 10=0.359, 100=0.2364, 500=0.1751, 1000=0.14884 (USD); Packaging: Cut Tape (CT); Part Status: Active; Voltage - Rated: 16V; Temperature Coefficient: X5R; Operating Temperature: -55°C ~ 85°C; Features: -; Ratings: -; Applications: General Purpose; Mounting Type: Surface Mount, MLCC; Package / Case: 0805 (2012 Metric); Size / Dimension: 0.079" L x 0.049" W (2.00mm x 1.25mm); Height - Seated (Max): -; Thickness (Max): 0.039" (1.00mm); Lead Spacing: -; Lead Style: -; ComponentLink1URL: http://search.murata.co.jp/Ceramy/image/img/A01X/G101/ENG/GRM219R61C226ME15-01.pdf; ComponentLink1Description: http://search.murata.co.jp/Ceramy/image/img/A01X/G101/ENG/GRM219R61C226ME15-01.pdf
C7-C9 C12 = CMP-1036-04795-1: as C1 on sheet LM_001; Supplier 1: Digi-Key; Supplier Part Number 1: 490-1673-6-ND; RoHS: RoHS Compliant; Category: Capacitors; Stock 1: 891652; Pricing 1: 1=0.2, 10=0.145, 100=0.0683, 500=0.04788, 1000=0.03964 (USD); Packaging: Digi-Reel®; Part Status: Active; Voltage - Rated: 25V; Temperature Coefficient: X7R; Operating Temperature: -55°C ~ 125°C; Features: -; Ratings: -; Applications: General Purpose; Mounting Type: Surface Mount, MLCC; Package / Case: 0805 (2012 Metric); Size / Dimension: 0.079" L x 0.049" W (2.00mm x 1.25mm); Height - Seated (Max): -; Thickness (Max): 0.053" (1.35mm); Lead Spacing: -; Lead Style: -; ComponentLink1URL: http://www.murata.com/~/media/webrenewal/support/library/catalog/products/capacitor/mlcc/c02e.ashx; ComponentLink1Description: http://www.murata.com/~/media/webrenewal/support/library/catalog/products/capacitor/mlcc/c02e.ashx
C22 C23 = CMP-1036-04795-1: as C14 on sheet LM_001; Supplier 1: Digi-Key; Supplier Part Number 1: 445-14483-6-ND; RoHS: RoHS Compliant; Category: Capacitors; Stock 1: 0; Pricing 1: 1=0.38, 10=0.259, 100=0.1466, 500=0.1035, 1000=0.09056 (USD); Packaging: Digi-Reel®; Part Status: Active; Voltage - Rated: 16V; Temperature Coefficient: X6S; Operating Temperature: -55°C ~ 105°C; Features: Low ESL; Ratings: -; Applications: General Purpose; Failure Rate: -; Mounting Type: Surface Mount, MLCC; Package / Case: 0805 (2012 Metric); Size / Dimension: 0.079" L x 0.049" W (2.00mm x 1.25mm); Height - Seated (Max): -; Thickness (Max): 0.039" (1.00mm); Lead Spacing: -; Lead Style: -; ComponentLink1URL: https://product.tdk.com/info/en/catalog/datasheets/mlcc_commercial_general_en.pdf; ComponentLink1Description: https://product.tdk.com/info/en/catalog/datasheets/mlcc_commercial_general_en.pdf
R22 R38 = CMP-1013-00393-1: CRCW080510K0FKEA
R23 R36 = CMP-1013-00393-1: RES SMD 1K OHM 1% 1/8W 0805; Manufacturer: Vishay Dale; Manufacturer Part Number: CRCW08051K00FKEA; Power (Watts): 0.125W, 1/8W; Temperature Coefficient: ±100ppm/°C; Supplier 1: Digi-Key; Supplier Part Number 1: 541-1.00KCCT-ND; RoHS: RoHS Compliant; Category: Resistors; Stock 1: 157631; Pricing 1: 1=0.1, 10=0.055, 100=0.0223, 1000=0.01003, 2500=0.0087 (USD); Packaging: Cut Tape (CT); Part Status: Active; Tolerance: ±1%; Composition: Thick Film; Features: Automotive AEC-Q200; Operating Temperature: -55°C ~ 155°C; Package / Case: 0805 (2012 Metric); Supplier Device Package: 0805; Size / Dimension: 0.079" L x 0.049" W (2.00mm x 1.25mm); Height - Seated (Max): 0.020" (0.50mm); Failure Rate: -; ComponentLink1URL: http://www.vishay.com/docs/20035/dcrcwe3.pdf; ComponentLink1Description: http://www.vishay.com/docs/20035/dcrcwe3.pdf
R24 R28 R33 R37 R45 R47 = CMP-1013-00393-1: RES SMD 10K OHM 1% 1/8W 0805; Manufacturer: Vishay Dale; Manufacturer Part Number: CRCW080510K0FKEA; Power (Watts): 0.125W, 1/8W; Temperature Coefficient: ±100ppm/°C; Supplier 1: Digi-Key; Supplier Part Number 1: 541-10.0KCCT-ND; RoHS: RoHS Compliant; Category: Resistors; Stock 1: 1858038; Pricing 1: 1=0.1, 10=0.055, 100=0.0223, 1000=0.01003, 2500=0.0087 (USD); Packaging: Cut Tape (CT); Part Status: Active; Tolerance: ±1%; Composition: Thick Film; Features: Automotive AEC-Q200; Operating Temperature: -55°C ~ 155°C; Package / Case: 0805 (2012 Metric); Supplier Device Package: 0805; Size / Dimension: 0.079" L x 0.049" W (2.00mm x 1.25mm); Height - Seated (Max): 0.020" (0.50mm); Failure Rate: -; ComponentLink1URL: http://www.vishay.com/docs/20035/dcrcwe3.pdf; ComponentLink1Description: http://www.vishay.com/docs/20035/dcrcwe3.pdf
R26 R40 = CMP-1013-00393-1: RES SMD 24.3K OHM 1% 1/8W 0805; Manufacturer: Vishay Dale; Manufacturer Part Number: CRCW080524K3FKEA; Power (Watts): 0.125W, 1/8W; Temperature Coefficient: ±100ppm/°C; Supplier 1: Digi-Key; Supplier Part Number 1: 541-24.3KCCT-ND; RoHS: RoHS Compliant; Category: Resistors; Stock 1: 35; Pricing 1: 1=0.1, 10=0.055, 100=0.0223, 1000=0.01003, 2500=0.0087 (USD); Packaging: Cut Tape (CT); Part Status: Active; Tolerance: ±1%; Composition: Thick Film; Features: Automotive AEC-Q200; Operating Temperature: -55°C ~ 155°C; Package / Case: 0805 (2012 Metric); Supplier Device Package: 0805; Size / Dimension: 0.079" L x 0.049" W (2.00mm x 1.25mm); Height - Seated (Max): 0.020" (0.50mm); Failure Rate: -; ComponentLink1URL: http://www.vishay.com/docs/20035/dcrcwe3.pdf; ComponentLink1Description: http://www.vishay.com/docs/20035/dcrcwe3.pdf
R29 R46 = CMP-1013-00393-1: RES SMD 1.21K OHM 1% 1/8W 0805; Manufacturer: Vishay Dale; Manufacturer Part Number: CRCW08051K21FKEA; Power (Watts): 0.125W, 1/8W; Temperature Coefficient: ±100ppm/°C; Supplier 1: Digi-Key; Supplier Part Number 1: 541-1.21KCCT-ND; RoHS: RoHS Compliant; Category: Resistors; Stock 1: 93438; Pricing 1: 1=0.1, 10=0.055, 100=0.0223, 1000=0.01003, 2500=0.0087 (USD); Packaging: Cut Tape (CT); Part Status: Active; Tolerance: ±1%; Composition: Thick Film; Features: Automotive AEC-Q200; Operating Temperature: -55°C ~ 155°C; Package / Case: 0805 (2012 Metric); Supplier Device Package: 0805; Size / Dimension: 0.079" L x 0.049" W (2.00mm x 1.25mm); Height - Seated (Max): 0.020" (0.50mm); Failure Rate: -; ComponentLink1URL: http://www.vishay.com/docs/20035/dcrcwe3.pdf; ComponentLink1Description: http://www.vishay.com/docs/20035/dcrcwe3.pdf
R30 R32 R42 R44 = CMP-1013-00393-1: RES SMD 249K OHM 1% 1/8W 0805; Manufacturer: Vishay Dale; Manufacturer Part Number: CRCW0805249KFKECC; Power (Watts): 0.125W, 1/8W; Temperature Coefficient: ±100ppm/°C; Supplier 1: Digi-Key; Supplier Part Number 1: 541-4128-1-ND; RoHS: RoHS Compliant; Category: Resistors; Stock 1: 19464; Pricing 1: 1=0.1, 10=0.06, 100=0.0244, 1000=0.01094, 2500=0.0095, 5000=0.00785 (USD); Packaging: Cut Tape (CT); Part Status: Active; Tolerance: ±1%; Composition: Thick Film; Features: -; Operating Temperature: -55°C ~ 155°C; Package / Case: 0805 (2012 Metric); Supplier Device Package: 0805; Size / Dimension: 0.079" L x 0.049" W (2.00mm x 1.25mm); Height - Seated (Max): 0.024" (0.60mm); Failure Rate: -; ComponentLink1URL: http://www.vishay.com/docs/28773/crcwce3.pdf; ComponentLink1Description: http://www.vishay.com/docs/28773/crcwce3.pdf
R57 R58 = CMP-1013-00606-1: RES SMD 1.6K OHM 1% 1/8W 0805
R59 R60 = CMP-1013-00393-1: RES SMD 50K OHM 1% 1/8W 0805; Temperature Coefficient: ±100ppm/°C; Supplier Part Number 1: 541-4128-1-ND; Tolerance: ±1%; Supplier Device Package: 0805
TP1-TP8 = CMP-1672-00009-1: Test Point, Orange, 1-Pin THD, RoHS; Manufacturer: Keystone Electronics; Manufacturer Part Number: 5003; Peak Reverse Current: 600 uA; Forward Current: 3 A; Max Surge Current: 80 A; Forward Voltage: 1.08 V; Plating: Silver; Body Material: PBT; Outside Diameter: 2.54mm; Inside Diameter: 1.27mm; Max Operating Temperature: 150 degC; PackageReference: 5003; Pins: 2; ComponentLink2URL: http://keyelco.com/userAssets/file/M65p56.pdf; PackageDescription: 1-Pin Through Hole Device, Dia 2.54 mm; Weight: 0.01 lb; Diameter: 5.3 mm; Mount: Through Hole; Package Quantity: 500; Packaging: Bulk; Min Operating Temperature: -65 degC; ComponentLink1Description: Manufacturer URL; Height: 0.25 inch; ComponentLink1URL: http://www.keyelco.com/; ComponentLink2Description: Datasheet; Width: 0.25 inch; REACH SVHC: No SVHC; RoHSCompliant: true; Radiation Hardening: No; Length: 9.5 mm; DatasheetVersion: Jun-15; Supplier 1: Future Electronics; Supplier Part Number 1: 1432640; Stock 1: 5752; Pricing 1: 100=0.176, 500=0.148, 1000=0.146, 2000=0.143, 4000=0.141 (USD); Number of Pins: 1; Colour: Orange,White; Contact Material: Bronze; Contact Plating: Silver,Tin; Material: Bronze,Nylon,Silver; Termination: Through Hole; Lead Free: Lead Free; Flammability Rating: UL94 V-0
U4 = CMP-0055-00867-3: Low Power CMOS Dual Operational Amplifier, 8-pin Narrow SOIC; Manufacturer: Texas Instruments; PowerWise: N; CompType: Amplifiers; PackageTopMarking: NSZXTT*LPC66*2AIM; PinCount: 8; Code_JEDEC: MS-012-AA; ComponentLink1URL: http://www.ti.com/general/docs/lit/getliterature.tsp?genericPartNumber=LPC662&fileType=pdf; Code_IPC: SOIC127P600-8; Package Reference: D0008A; PackageDescription: SOIC Narrow, 4.9 x 3.9 x 1.45mm, 8 Lead, 1.27mm Pitch; RoHS: N; ComponentLink1Description: Datasheet URL; PartId: 1
U5 U7 = SA40012: Single Axix CMOS Signal Conditioning Module; Manufacturer: Spectron; Manufacturer Part Number: A40012
U6 = CMP-0055-00867-3: Low Power CMOS Dual Operational Amplifier, 8-pin Narrow SOIC; Manufacturer: Texas Instruments; Manufacturer Part Number: LPC662AIMX/NOPB; Amplifier Type: General Purpose; Output Type: Rail-to-Rail; Slew Rate: 0.11 V/µs; Current - Supply: 86µA; Voltage - Supply, Single/Dual (±): 4.75 V ~ 15.5 V, ±2.38 V ~ 7.75 V; Supplier 1: Digi-Key; Supplier Part Number 1: 296-35456-1-ND; RoHS: RoHS Compliant; Category: Integrated Circuits (ICs); Stock 1: 4976; Pricing 1: 1=2.98, 10=2.672, 100=2.1893, 500=1.86368, 1000=1.57178 (USD); Packaging: Cut Tape (CT); Part Status: Active; Operating Temperature: -40°C ~ 85°C; Mounting Type: Surface Mount; Package / Case: 8-SOIC (0.154", 3.90mm Width); Supplier Device Package: 8-SOIC; Base Part Number: LPC662; ComponentLink1URL: http://www.ti.com/lit/ds/symlink/lpc662.pdf; ComponentLink1Description: http://www.ti.com/lit/ds/symlink/lpc662.pdf

## Nets that join several sheets
+5: LM_001 (16 pins), Signal_Conditioner (6 pins)
GND: LM_001 (35 pins), Signal_Conditioner (12 pins)
CROSS NEUTRAL: LM_001 (P1.2), Signal_Conditioner (U7.25)
LONG NEUTRAL: LM_001 (P2.2), Signal_Conditioner (U5.25)
NetC6_2: LM_001 (P2.1), Signal_Conditioner (C6.2 U5.27)
NetC11_2: LM_001 (P1.1), Signal_Conditioner (C11.2 U7.27)
NetC22_1: LM_001 (U2.10), Signal_Conditioner (C22.1 R57.1 TP2.1)
NetC23_1: LM_001 (U2.11), Signal_Conditioner (C23.1 R58.1 TP6.1)
NetP1_3: LM_001 (P1.3), Signal_Conditioner (U7.24)
NetP2_3: LM_001 (P2.3), Signal_Conditioner (U5.24)